# Altium project select_system.PrjPcb
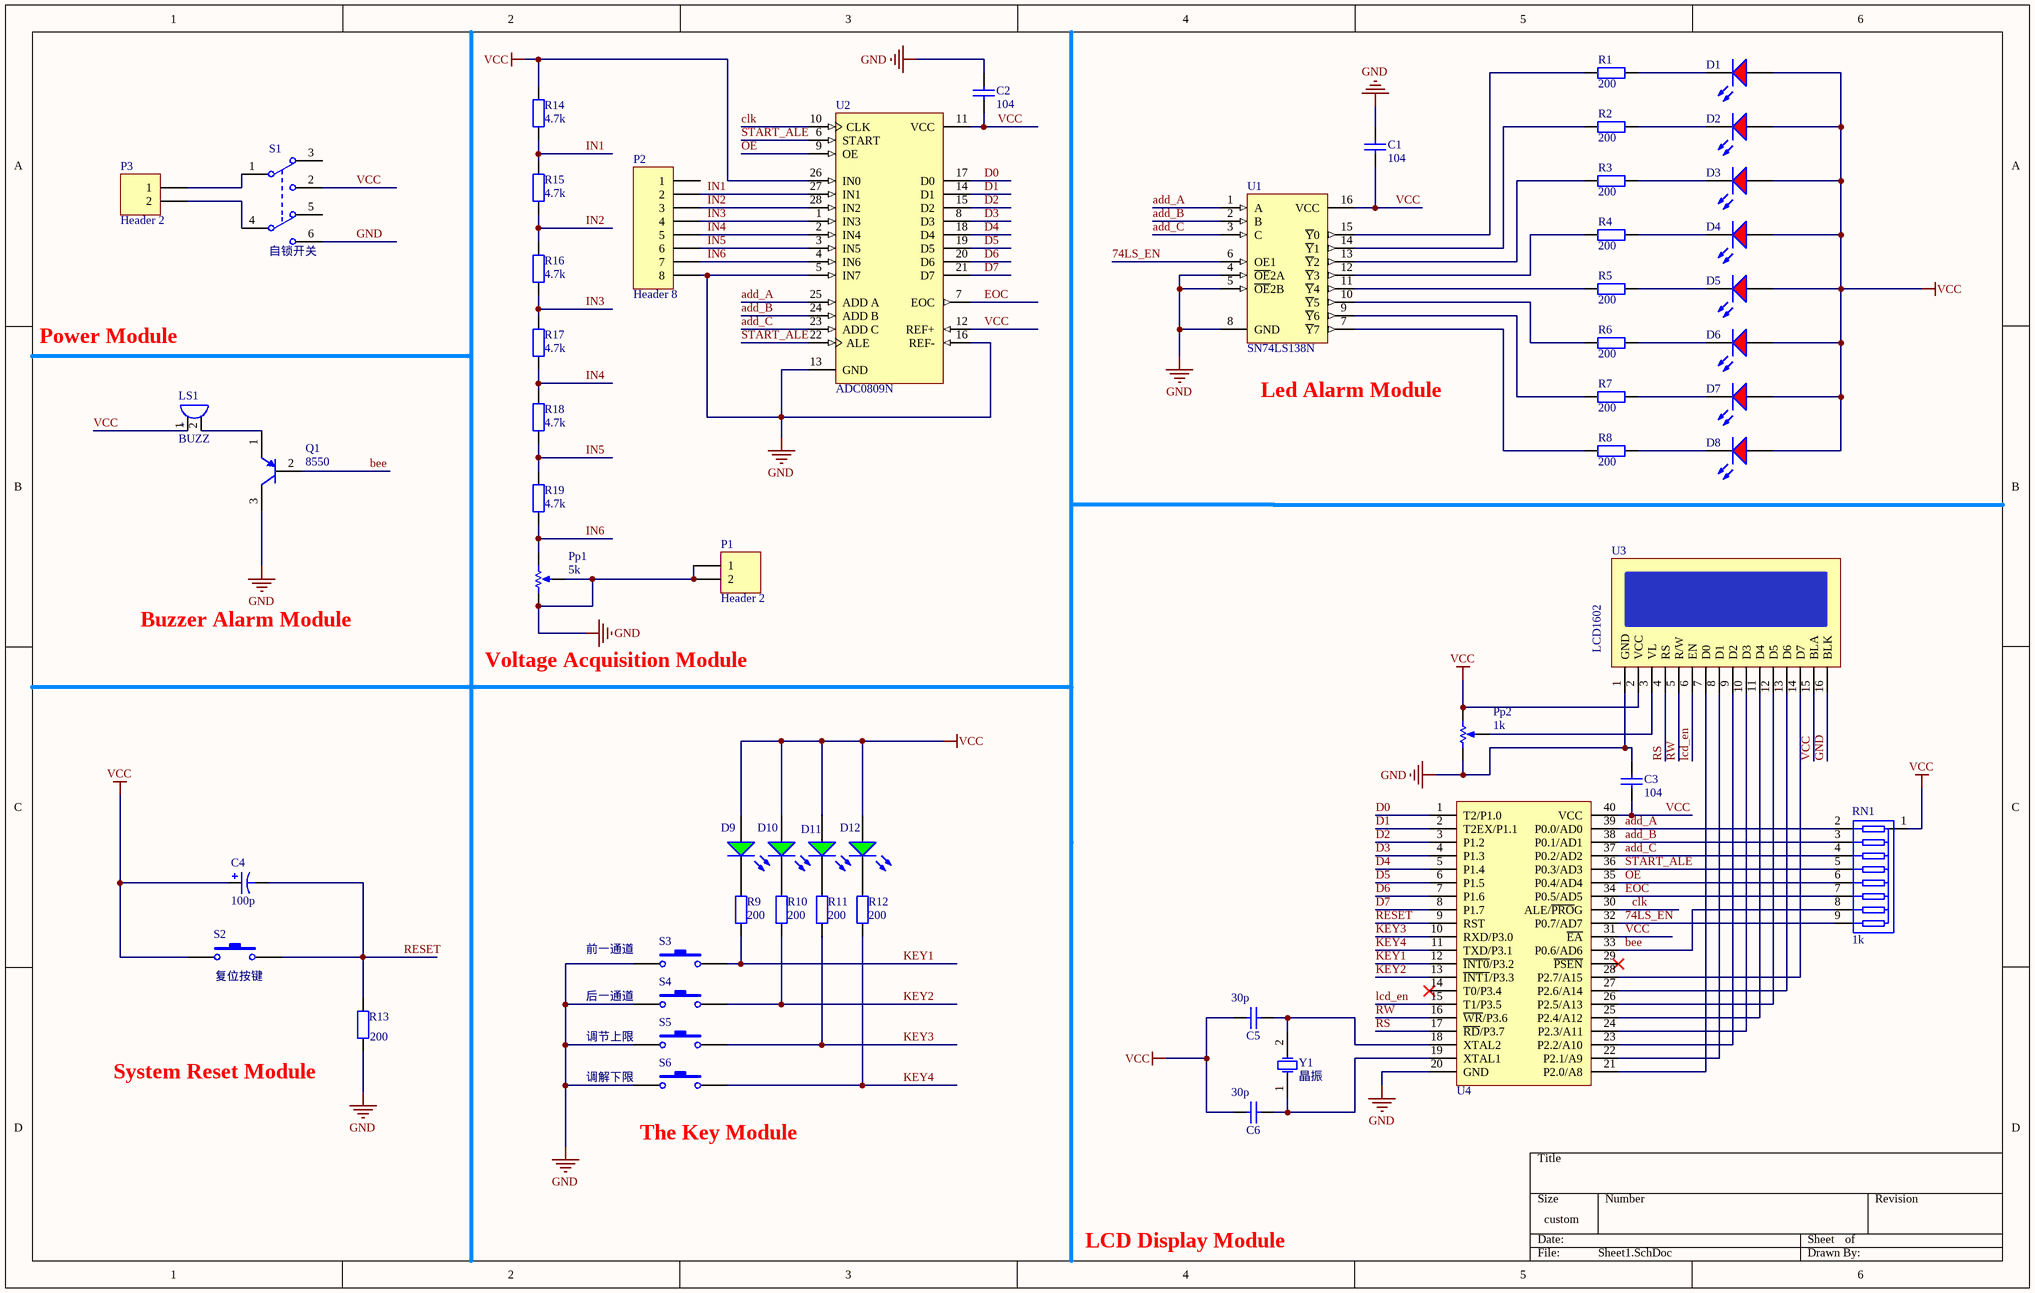
[diagram p0: Sheet1.SchDoc]
1 sheet, 56 parts. Net scope: global (net labels, ports and power ports of the same name join across sheets).
Board file: PCB1.PcbDoc

## Sheet Sheet1.SchDoc
size 381 x 241 mm

### Parts
C1  104  [CAP-0.1]
C2  104  [CAP-0.1]
C3  104  [CAP-0.1]
C4  100p  [CAP 2.0*5*11]
C5  30p  [CAP-0.1]
C6  30p  [CAP-0.1]
D1  直径5mm的红灯  [LED 5MM-R]  (value not drawn)
D2  直径5mm的红灯  [LED 5MM-R]  (value not drawn)
D3  直径5mm的红灯  [LED 5MM-R]  (value not drawn)
D4  直径5mm的红灯  [LED 5MM-R]  (value not drawn)
D5  直径5mm的红灯  [LED 5MM-R]  (value not drawn)
D6  直径5mm的红灯  [LED 5MM-R]  (value not drawn)
D7  直径5mm的红灯  [LED 5MM-R]  (value not drawn)
D8  直径5mm的红灯  [LED 5MM-R]  (value not drawn)
D9  直径5mm的绿灯  [LED 3MM-G]  (value not drawn)
D10  直径5mm的绿灯  [LED 3MM-G]  (value not drawn)
D11  直径5mm的绿灯  [LED 3MM-G]  (value not drawn)
D12  直径5mm的绿灯  [LED 3MM-G]  (value not drawn)
LS1  BUZZ  [Beep_small]
P1  Header 2  [HDR1X2]
P2  Header 8  [HDR1X8]
P3  Header 2  [HX2.54-2]
Pp1  5k  [RP_3296]
Pp2  1k  [RP_3296]
Q1  8550  [TO-92(TO-92-3)]
R1  200  [AXIAL-0.3-R]
R2  200  [AXIAL-0.3-R]
R3  200  [AXIAL-0.3-R]
R4  200  [AXIAL-0.3-R]
R5  200  [AXIAL-0.3-R]
R6  200  [AXIAL-0.3-R]
R7  200  [AXIAL-0.3-R]
R8  200  [AXIAL-0.3-R]
R9  200  [AXIAL-0.3-R]
R10  200  [AXIAL-0.3-R]
R11  200  [AXIAL-0.3-R]
R12  200  [AXIAL-0.3-R]
R13  200  [AXIAL-0.3-R]
R14  4.7k  [AXIAL-0.3-R]
R15  4.7k  [AXIAL-0.3-R]
R16  4.7k  [AXIAL-0.3-R]
R17  4.7k  [AXIAL-0.3-R]
R18  4.7k  [AXIAL-0.3-R]
R19  4.7k  [AXIAL-0.3-R]
RN1  value 1k  [RES-PACK-DIP9]  (hidden comment: Res_Pack_Single)
S1  自锁开关  [sw_8.5mm]
S2  复位按键  [BUTTON_6*6]
S3  前一通道  [BUTTON_6*6]
S4  后一通道  [BUTTON_6*6]
S5  调节上限  [BUTTON_6*6]
S6  调解下限  [BUTTON_6*6]
U1  SN74LS138N  [DIP16-300_MH]
U2  ADC0809N  [DIP28-600]
U3  LCD1602  [LCD1602]
U4  AT89C52  [DIP-40]  (value not drawn)
Y1  晶振  [cry卧式]

### Nets
GND: C1.2 C2.2 C3.2 P1.1 P1.2 P2.8 Pp1.1(TOP) Pp1.2(TAP) Pp2.1(TOP) Q1.3(C) R13.1 S1.6 S3.1 S4.1 S5.1 S6.1 U1.4(~{OE}2A) U1.5(~{OE}2B) U1.8(GND) U2.5(IN7) U2.13(GND) U2.16(REF-) U3.1(GND) U3.16(BLK) U4.20(GND)
VCC: C1.1 C2.1 C3.1 C4.1 C5.1 C6.1 D1.1(A) D2.1(A) D3.1(A) D4.1(A) D5.1(A) D6.1(A) D7.1(A) D8.1(A) D9.1(A) D10.1(A) D11.1(A) D12.1(A) LS1.1 Pp2.3(BOT) R14.2 RN1.1 S1.2 S2.1 U1.16(VCC) U2.11(VCC) U2.12(REF+) U2.26(IN0) U3.2(VCC) U3.15(BLA) U4.31(~{EA}) U4.40(VCC)
74LS_EN: RN1.9 U1.6(OE1) U4.32(P0.7/AD7)
add_A: RN1.2 U1.1(A) U2.25(ADD_A) U4.39(P0.0/AD0)
add_B: RN1.3 U1.2(B) U2.24(ADD_B) U4.38(P0.1/AD1)
add_C: RN1.4 U1.3(C) U2.23(ADD_C) U4.37(P0.2/AD2)
bee: Q1.2(B) RN1.8 U4.33(P0.6/AD6)
clk: U2.10(CLK) U4.30(ALE/~{PRO}G)
D0: U2.17(D0) U4.1(T2/P1.0)
D1: U2.14(D1) U4.2(T2EX/P1.1)
D2: U2.15(D2) U4.3(P1.2)
D3: U2.8(D3) U4.4(P1.3)
D4: U2.18(D4) U4.5(P1.4)
D5: U2.19(D5) U4.6(P1.5)
D6: U2.20(D6) U4.7(P1.6)
D7: U2.21(D7) U4.8(P1.7)
EOC: RN1.7 U2.7(EOC) U4.34(P0.5/AD5)
IN1: P2.2 R14.1 R15.2 U2.27(IN1)
IN2: P2.3 R15.1 R16.2 U2.28(IN2)
IN3: P2.4 R16.1 R17.2 U2.1(IN3)
IN4: P2.5 R17.1 R18.2 U2.2(IN4)
IN5: P2.6 R18.1 R19.2 U2.3(IN5)
IN6: P2.7 Pp1.3(BOT) R19.1 U2.4(IN6)
KEY1: R9.1 S3.2 U4.12(~{INT0}/P3.2)
KEY2: R10.1 S4.2 U4.13(~{INT1}/P3.3)
KEY3: R11.1 S5.2 U4.10(RXD/P3.0)
KEY4: R12.1 S6.2 U4.11(TXD/P3.1)
lcd_en: U3.6(EN) U4.15(T1/P3.5)
OE: RN1.6 U2.9(OE) U4.35(P0.4/AD4)
RESET: C4.2 R13.2 S2.2 U4.9(RST)
RS: U3.4(RS) U4.17(~{RD}/P3.7)
RW: U3.5(R/W) U4.16(~{WR}/P3.6)
START_ALE: RN1.5 U2.6(START) U2.22(ALE) U4.36(P0.3/AD3)
NetC5_2: C5.2 U4.18(XTAL2) Y1.2(OSC2)
NetC6_2: C6.2 U4.19(XTAL1) Y1.1(OSC1)
NetD1_2: D1.2(K) R1.1
NetD2_2: D2.2(K) R2.1
NetD3_2: D3.2(K) R3.1
NetD4_2: D4.2(K) R4.1
NetD5_2: D5.2(K) R5.1
NetD6_2: D6.2(K) R6.1
NetD7_2: D7.2(K) R7.1
NetD8_2: D8.2(K) R8.1
NetD9_2: D9.2(K) R9.2
NetD10_2: D10.2(K) R10.2
NetD11_2: D11.2(K) R11.2
NetD12_2: D12.2(K) R12.2
NetLS1_2: LS1.2 Q1.1(E)
NetP3_1: P3.1 S1.1
NetP3_2: P3.2 S1.4
NetPp2_2: Pp2.2(TAP) U3.3(VL)
NetR1_2: R1.2 U1.15(~{Y}0)
NetR2_2: R2.2 U1.14(~{Y}1)
NetR3_2: R3.2 U1.13(~{Y}2)
NetR4_2: R4.2 U1.12(~{Y}3)
NetR5_2: R5.2 U1.11(~{Y}4)
NetR6_2: R6.2 U1.10(~{Y}5)
NetR7_2: R7.2 U1.9(~{Y}6)
NetR8_2: R8.2 U1.7(~{Y}7)
NetU3_7: U3.7(D0) U4.21(P2.0/A8)
NetU3_8: U3.8(D1) U4.22(P2.1/A9)
NetU3_9: U3.9(D2) U4.23(P2.2/A10)
NetU3_10: U3.10(D3) U4.24(P2.3/A11)
NetU3_11: U3.11(D4) U4.25(P2.4/A12)
NetU3_12: U3.12(D5) U4.26(P2.5/A13)
NetU3_13: U3.13(D6) U4.27(P2.6/A14)
NetU3_14: U3.14(D7) U4.28(P2.7/A15)

Not connected (* = marked no-connect by the designer): P2 1; S1 3 5; U4 14(T0/P3.4)* 29(~{PSEN})*

### Notes on the sheet
- Power Module
- (near U1) Led Alarm Module
- Buzzer Alarm Module
- Voltage Acquisition Module
- (near R13) System Reset Module
- (near S6) The Key Module
- LCD Display Module
- (in symbol BUZZ) +

### Library data of the parts
C1-C3 = Cap_ceramic: Capacitor 瓷片电容 无极性电容; Published: 8-Jun-2000; LatestRevisionDate: 17-Jul-2002; LatestRevisionNote: Re-released for DXP Platform.; PackageReference: RAD-0.3; Publisher: Altium Limited; Value: 104
C4 = Cap Pol2: Polarized Capacitor (Axial); Published: 8-Jun-2000; LatestRevisionDate: 17-Jul-2002; LatestRevisionNote: Re-released for DXP Platform.; PackageReference: POLAR0.8; Publisher: Altium Limited; PackageDescription: Polarized Capacitor; 2 Leads
C5 C6 = Cap_ceramic: Capacitor 瓷片电容 无极性电容; Value: 104; Published: 8-Jun-2000; LatestRevisionDate: 17-Jul-2002; LatestRevisionNote: Re-released for DXP Platform.; PackageReference: RAD-0.3; Publisher: Altium Limited
D1-D8 = LED_5#红灯: 直径5mm的发光二极管; Value: 红灯
D9-D12 = LED_5#绿灯: 直径5mm的发光二极管
LS1 = BUZZ: 蜂鸣器
P1 P3 = Header 2: Header, 2-Pin; LatestRevisionDate: 17-Jul-2002; LatestRevisionNote: Re-released for DXP Platform.; Publisher: Altium Limited
P2 = Header 8: Header, 8-Pin; LatestRevisionDate: 17-Jul-2002; LatestRevisionNote: Re-released for DXP Platform.; Publisher: Altium Limited
Pp1 Pp2 = RP_3296: 3296电位器; 购买链接: https://item.taobao.com/item.htm?spm=a230r.1.14.90.21641e34zQj3ul&id=19303265869&ns=1&abbucket=13#detail
Q1 = 8550_TO-92: PNP型小功率三极管; HelpURL: https://baike.baidu.com/item/%E4%B8%89%E6%9E%81%E7%AE%A18550/862606
R1-R19 = Res2_1/2W: Resistor 直插电阻 0.5W; Published: 8-Jun-2000; LatestRevisionDate: 17-Jul-2002; LatestRevisionNote: Re-released for DXP Platform.; PackageReference: AXIAL-0.4; Publisher: Altium Limited
  R1-R13: Value: 200
  R14-R19: Value: 4.7k
RN1 = Res_Pack_Single: 排阻
S1 = SW DPDT
S2-S6 = SW-PB: Tactile Switch触觉开关; Published: 24-Mar-1999; LatestRevisionDate: 17-Jul-2002; LatestRevisionNote: Re-released for DXP Platform.; PackageReference: SPST-2; Publisher: Altium Limited
U1 = SN74LS138N: 3-Line to 8-Line Decoder / Demultiplexer; Published: 8-Jun-2000; LatestRevisionDate: 04-Mar-2005; LatestRevisionNote: Stylized 3D Model Added.; DatasheetVersion: Mar-1988; PackageVersion: Oct-1995; PackageReference: N016; Publisher: Altium Limited; PackageDescription: DIP; 16 Leads; Row Spacing 7.62 mm; Pitch 2.54 mm; Code_JEDEC: MS-001-BB; ComponentLink1Description: Manufacturer Link; ComponentLink1URL: http://www.ti.com/; ComponentLink2Description: Datasheet; ComponentLink2URL: http://www-s.ti.com/sc/ds/sn74ls138.pdf
U2 = ADC0809N: CMOS Analog-to-Digital Converter with 8-Channel Multiplexer; ComponentAvailability: Obsolete; Published: 15-Apr-2002; LatestRevisionDate: 08-Jul-2005; LatestRevisionNote: Stylized 3D Model Added.; DatasheetVersion: May-1988; PackageVersion: Oct-1994; PackageReference: N028; Publisher: Altium Limited; PackageDescription: DIP; 28 Leads; Row Spacing 15.24 mm; Pitch 2.54 mm; ComponentLink1Description: Manufacturer Link; ComponentLink1URL: http://www.ti.com/
U4 = AT89C52RC-DIP: AT89C52RC_DIP40
Y1 = Crystal 11.05292/12/16/24/MHz: 直插晶振11.05292/12/16/24/MHz